# EAGLE schematic 15TB (EAGLE 9.6.0), part 2 of 2
## Sheet 4 of 4
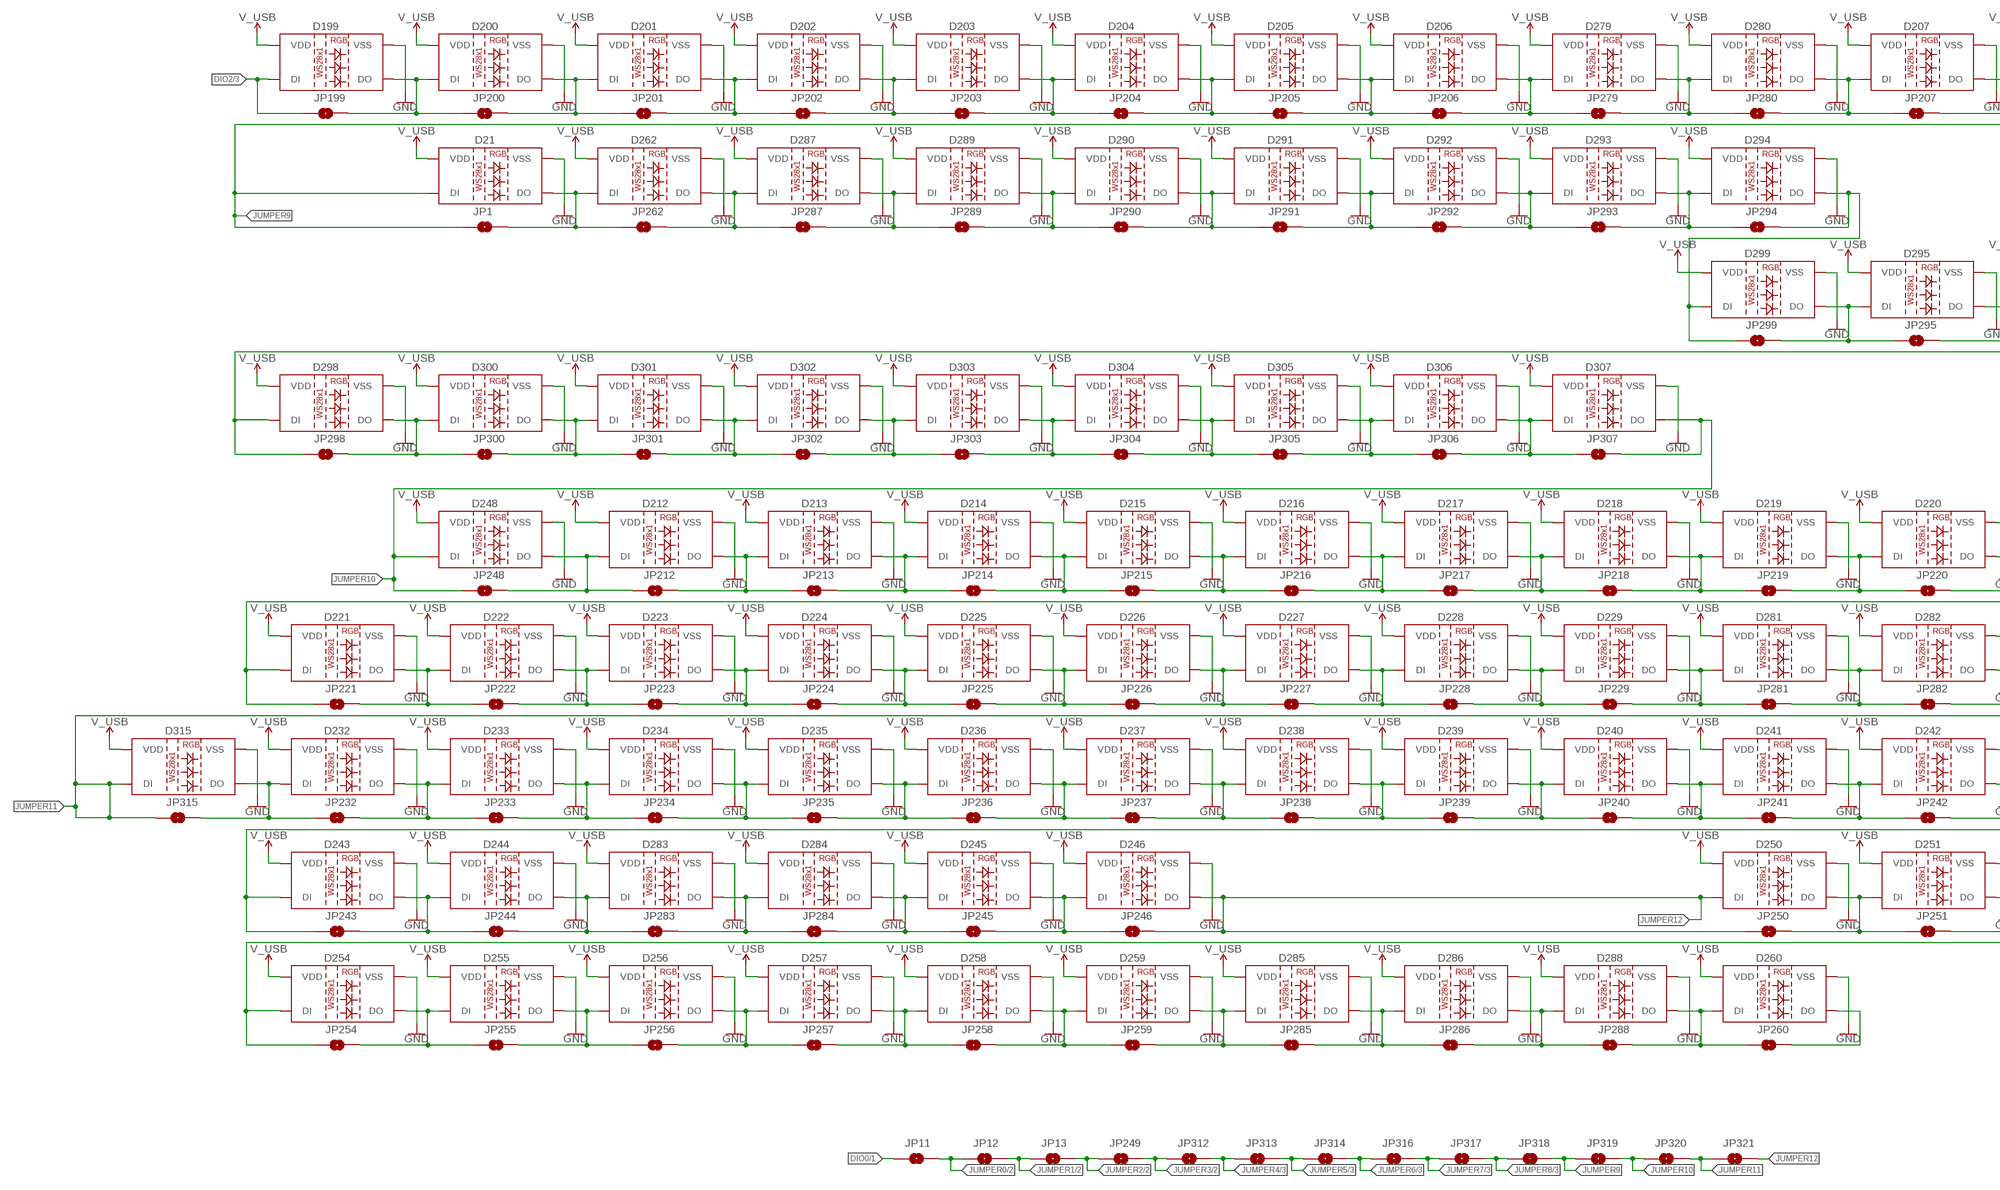
[diagram p5: schematic, sheet 4, part 1 of 2]
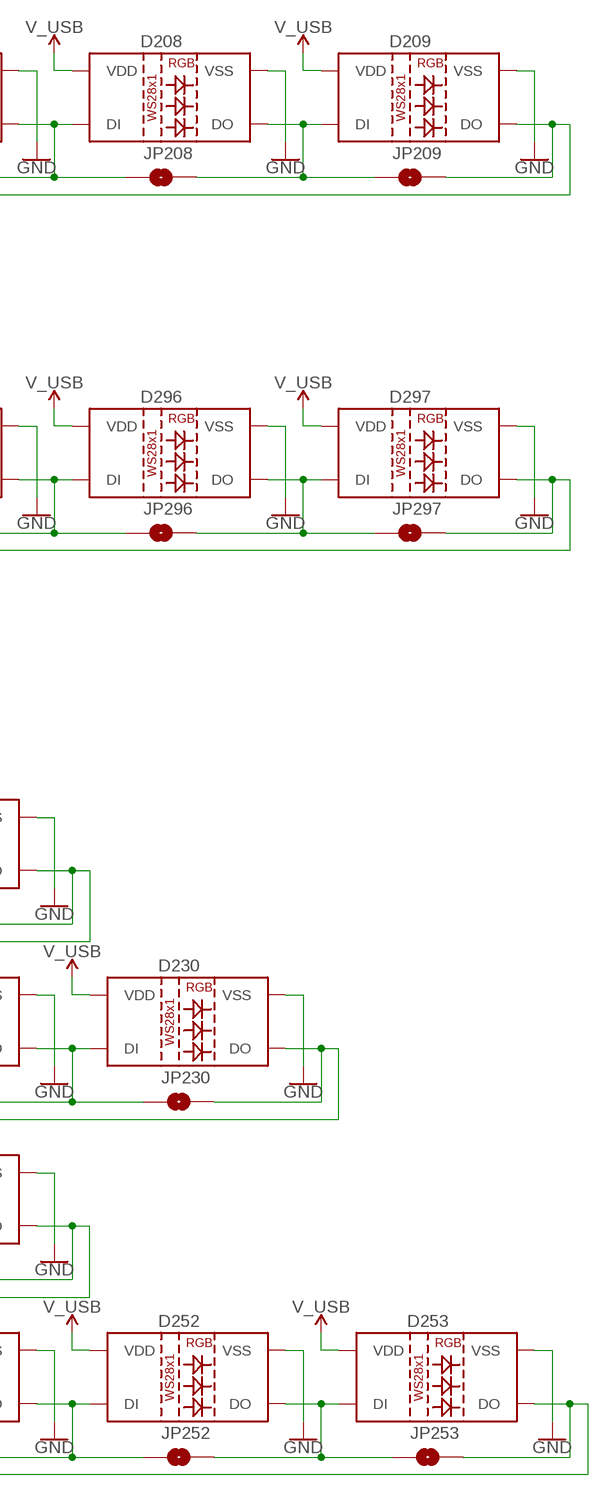
[diagram p6: schematic, sheet 4, part 2 of 2]

### Parts
D21  WS2812B  [WS2812B]
D199  WS2812B  [WS2812B]
D200  WS2812B  [WS2812B]
D201  WS2812B  [WS2812B]
D202  WS2812B  [WS2812B]
D203  WS2812B  [WS2812B]
D204  WS2812B  [WS2812B]
D205  WS2812B  [WS2812B]
D206  WS2812B  [WS2812B]
D207  WS2812B  [WS2812B]
D208  WS2812B  [WS2812B]
D209  WS2812B  [WS2812B]
D212  WS2812B  [WS2812B]
D213  WS2812B  [WS2812B]
D214  WS2812B  [WS2812B]
D215  WS2812B  [WS2812B]
D216  WS2812B  [WS2812B]
D217  WS2812B  [WS2812B]
D218  WS2812B  [WS2812B]
D219  WS2812B  [WS2812B]
D220  WS2812B  [WS2812B]
D221  WS2812B  [WS2812B]
D222  WS2812B  [WS2812B]
D223  WS2812B  [WS2812B]
D224  WS2812B  [WS2812B]
D225  WS2812B  [WS2812B]
D226  WS2812B  [WS2812B]
D227  WS2812B  [WS2812B]
D228  WS2812B  [WS2812B]
D229  WS2812B  [WS2812B]
D230  WS2812B  [WS2812B]
D232  WS2812B  [WS2812B]
D233  WS2812B  [WS2812B]
D234  WS2812B  [WS2812B]
D235  WS2812B  [WS2812B]
D236  WS2812B  [WS2812B]
D237  WS2812B  [WS2812B]
D238  WS2812B  [WS2812B]
D239  WS2812B  [WS2812B]
D240  WS2812B  [WS2812B]
D241  WS2812B  [WS2812B]
D242  WS2812B  [WS2812B]
D243  WS2812B  [WS2812B]
D244  WS2812B  [WS2812B]
D245  WS2812B  [WS2812B]
D246  WS2812B  [WS2812B]
D248  WS2812B  [WS2812B]
D250  WS2812B  [WS2812B]
D251  WS2812B  [WS2812B]
D252  WS2812B  [WS2812B]
D253  WS2812B  [WS2812B]
D254  WS2812B  [WS2812B]
D255  WS2812B  [WS2812B]
D256  WS2812B  [WS2812B]
D257  WS2812B  [WS2812B]
D258  WS2812B  [WS2812B]
D259  WS2812B  [WS2812B]
D260  WS2812B  [WS2812B]
D262  WS2812B  [WS2812B]
D279  WS2812B  [WS2812B]
D280  WS2812B  [WS2812B]
D281  WS2812B  [WS2812B]
D282  WS2812B  [WS2812B]
D283  WS2812B  [WS2812B]
D284  WS2812B  [WS2812B]
D285  WS2812B  [WS2812B]
D286  WS2812B  [WS2812B]
D287  WS2812B  [WS2812B]
D288  WS2812B  [WS2812B]
D289  WS2812B  [WS2812B]
D290  WS2812B  [WS2812B]
D291  WS2812B  [WS2812B]
D292  WS2812B  [WS2812B]
D293  WS2812B  [WS2812B]
D294  WS2812B  [WS2812B]
D295  WS2812B  [WS2812B]
D296  WS2812B  [WS2812B]
D297  WS2812B  [WS2812B]
D298  WS2812B  [WS2812B]
D299  WS2812B  [WS2812B]
D300  WS2812B  [WS2812B]
D301  WS2812B  [WS2812B]
D302  WS2812B  [WS2812B]
D303  WS2812B  [WS2812B]
D304  WS2812B  [WS2812B]
D305  WS2812B  [WS2812B]
D306  WS2812B  [WS2812B]
D307  WS2812B  [WS2812B]
D315  WS2812B  [WS2812B]
JP1  JUMPER-SMT_2_NO_NO-SILK  [SMT-JUMPER_2_NO_NO-SILK]
JP11  JUMPER-SMT_2_NO_NO-SILK  [SMT-JUMPER_2_NO_NO-SILK]
JP12  JUMPER-SMT_2_NO_NO-SILK  [SMT-JUMPER_2_NO_NO-SILK]
JP13  JUMPER-SMT_2_NO_NO-SILK  [SMT-JUMPER_2_NO_NO-SILK]
JP199  JUMPER-SMT_2_NO_NO-SILK  [SMT-JUMPER_2_NO_NO-SILK]
JP200  JUMPER-SMT_2_NO_NO-SILK  [SMT-JUMPER_2_NO_NO-SILK]
JP201  JUMPER-SMT_2_NO_NO-SILK  [SMT-JUMPER_2_NO_NO-SILK]
JP202  JUMPER-SMT_2_NO_NO-SILK  [SMT-JUMPER_2_NO_NO-SILK]
JP203  JUMPER-SMT_2_NO_NO-SILK  [SMT-JUMPER_2_NO_NO-SILK]
JP204  JUMPER-SMT_2_NO_NO-SILK  [SMT-JUMPER_2_NO_NO-SILK]
JP205  JUMPER-SMT_2_NO_NO-SILK  [SMT-JUMPER_2_NO_NO-SILK]
JP206  JUMPER-SMT_2_NO_NO-SILK  [SMT-JUMPER_2_NO_NO-SILK]
JP207  JUMPER-SMT_2_NO_NO-SILK  [SMT-JUMPER_2_NO_NO-SILK]
JP208  JUMPER-SMT_2_NO_NO-SILK  [SMT-JUMPER_2_NO_NO-SILK]
JP209  JUMPER-SMT_2_NO_NO-SILK  [SMT-JUMPER_2_NO_NO-SILK]
JP212  JUMPER-SMT_2_NO_NO-SILK  [SMT-JUMPER_2_NO_NO-SILK]
JP213  JUMPER-SMT_2_NO_NO-SILK  [SMT-JUMPER_2_NO_NO-SILK]
JP214  JUMPER-SMT_2_NO_NO-SILK  [SMT-JUMPER_2_NO_NO-SILK]
JP215  JUMPER-SMT_2_NO_NO-SILK  [SMT-JUMPER_2_NO_NO-SILK]
JP216  JUMPER-SMT_2_NO_NO-SILK  [SMT-JUMPER_2_NO_NO-SILK]
JP217  JUMPER-SMT_2_NO_NO-SILK  [SMT-JUMPER_2_NO_NO-SILK]
JP218  JUMPER-SMT_2_NO_NO-SILK  [SMT-JUMPER_2_NO_NO-SILK]
JP219  JUMPER-SMT_2_NO_NO-SILK  [SMT-JUMPER_2_NO_NO-SILK]
JP220  JUMPER-SMT_2_NO_NO-SILK  [SMT-JUMPER_2_NO_NO-SILK]
JP221  JUMPER-SMT_2_NO_NO-SILK  [SMT-JUMPER_2_NO_NO-SILK]
JP222  JUMPER-SMT_2_NO_NO-SILK  [SMT-JUMPER_2_NO_NO-SILK]
JP223  JUMPER-SMT_2_NO_NO-SILK  [SMT-JUMPER_2_NO_NO-SILK]
JP224  JUMPER-SMT_2_NO_NO-SILK  [SMT-JUMPER_2_NO_NO-SILK]
JP225  JUMPER-SMT_2_NO_NO-SILK  [SMT-JUMPER_2_NO_NO-SILK]
JP226  JUMPER-SMT_2_NO_NO-SILK  [SMT-JUMPER_2_NO_NO-SILK]
JP227  JUMPER-SMT_2_NO_NO-SILK  [SMT-JUMPER_2_NO_NO-SILK]
JP228  JUMPER-SMT_2_NO_NO-SILK  [SMT-JUMPER_2_NO_NO-SILK]
JP229  JUMPER-SMT_2_NO_NO-SILK  [SMT-JUMPER_2_NO_NO-SILK]
JP230  JUMPER-SMT_2_NO_NO-SILK  [SMT-JUMPER_2_NO_NO-SILK]
JP232  JUMPER-SMT_2_NO_NO-SILK  [SMT-JUMPER_2_NO_NO-SILK]
JP233  JUMPER-SMT_2_NO_NO-SILK  [SMT-JUMPER_2_NO_NO-SILK]
JP234  JUMPER-SMT_2_NO_NO-SILK  [SMT-JUMPER_2_NO_NO-SILK]
JP235  JUMPER-SMT_2_NO_NO-SILK  [SMT-JUMPER_2_NO_NO-SILK]
JP236  JUMPER-SMT_2_NO_NO-SILK  [SMT-JUMPER_2_NO_NO-SILK]
JP237  JUMPER-SMT_2_NO_NO-SILK  [SMT-JUMPER_2_NO_NO-SILK]
JP238  JUMPER-SMT_2_NO_NO-SILK  [SMT-JUMPER_2_NO_NO-SILK]
JP239  JUMPER-SMT_2_NO_NO-SILK  [SMT-JUMPER_2_NO_NO-SILK]
JP240  JUMPER-SMT_2_NO_NO-SILK  [SMT-JUMPER_2_NO_NO-SILK]
JP241  JUMPER-SMT_2_NO_NO-SILK  [SMT-JUMPER_2_NO_NO-SILK]
JP242  JUMPER-SMT_2_NO_NO-SILK  [SMT-JUMPER_2_NO_NO-SILK]
JP243  JUMPER-SMT_2_NO_NO-SILK  [SMT-JUMPER_2_NO_NO-SILK]
JP244  JUMPER-SMT_2_NO_NO-SILK  [SMT-JUMPER_2_NO_NO-SILK]
JP245  JUMPER-SMT_2_NO_NO-SILK  [SMT-JUMPER_2_NO_NO-SILK]
JP246  JUMPER-SMT_2_NO_NO-SILK  [SMT-JUMPER_2_NO_NO-SILK]
JP248  JUMPER-SMT_2_NO_NO-SILK  [SMT-JUMPER_2_NO_NO-SILK]
JP249  JUMPER-SMT_2_NO_NO-SILK  [SMT-JUMPER_2_NO_NO-SILK]
JP250  JUMPER-SMT_2_NO_NO-SILK  [SMT-JUMPER_2_NO_NO-SILK]
JP251  JUMPER-SMT_2_NO_NO-SILK  [SMT-JUMPER_2_NO_NO-SILK]
JP252  JUMPER-SMT_2_NO_NO-SILK  [SMT-JUMPER_2_NO_NO-SILK]
JP253  JUMPER-SMT_2_NO_NO-SILK  [SMT-JUMPER_2_NO_NO-SILK]
JP254  JUMPER-SMT_2_NO_NO-SILK  [SMT-JUMPER_2_NO_NO-SILK]
JP255  JUMPER-SMT_2_NO_NO-SILK  [SMT-JUMPER_2_NO_NO-SILK]
JP256  JUMPER-SMT_2_NO_NO-SILK  [SMT-JUMPER_2_NO_NO-SILK]
JP257  JUMPER-SMT_2_NO_NO-SILK  [SMT-JUMPER_2_NO_NO-SILK]
JP258  JUMPER-SMT_2_NO_NO-SILK  [SMT-JUMPER_2_NO_NO-SILK]
JP259  JUMPER-SMT_2_NO_NO-SILK  [SMT-JUMPER_2_NO_NO-SILK]
JP260  JUMPER-SMT_2_NO_NO-SILK  [SMT-JUMPER_2_NO_NO-SILK]
JP262  JUMPER-SMT_2_NO_NO-SILK  [SMT-JUMPER_2_NO_NO-SILK]
JP279  JUMPER-SMT_2_NO_NO-SILK  [SMT-JUMPER_2_NO_NO-SILK]
JP280  JUMPER-SMT_2_NO_NO-SILK  [SMT-JUMPER_2_NO_NO-SILK]
JP281  JUMPER-SMT_2_NO_NO-SILK  [SMT-JUMPER_2_NO_NO-SILK]
JP282  JUMPER-SMT_2_NO_NO-SILK  [SMT-JUMPER_2_NO_NO-SILK]
JP283  JUMPER-SMT_2_NO_NO-SILK  [SMT-JUMPER_2_NO_NO-SILK]
JP284  JUMPER-SMT_2_NO_NO-SILK  [SMT-JUMPER_2_NO_NO-SILK]
JP285  JUMPER-SMT_2_NO_NO-SILK  [SMT-JUMPER_2_NO_NO-SILK]
JP286  JUMPER-SMT_2_NO_NO-SILK  [SMT-JUMPER_2_NO_NO-SILK]
JP287  JUMPER-SMT_2_NO_NO-SILK  [SMT-JUMPER_2_NO_NO-SILK]
JP288  JUMPER-SMT_2_NO_NO-SILK  [SMT-JUMPER_2_NO_NO-SILK]
JP289  JUMPER-SMT_2_NO_NO-SILK  [SMT-JUMPER_2_NO_NO-SILK]
JP290  JUMPER-SMT_2_NO_NO-SILK  [SMT-JUMPER_2_NO_NO-SILK]
JP291  JUMPER-SMT_2_NO_NO-SILK  [SMT-JUMPER_2_NO_NO-SILK]
JP292  JUMPER-SMT_2_NO_NO-SILK  [SMT-JUMPER_2_NO_NO-SILK]
JP293  JUMPER-SMT_2_NO_NO-SILK  [SMT-JUMPER_2_NO_NO-SILK]
JP294  JUMPER-SMT_2_NO_NO-SILK  [SMT-JUMPER_2_NO_NO-SILK]
JP295  JUMPER-SMT_2_NO_NO-SILK  [SMT-JUMPER_2_NO_NO-SILK]
JP296  JUMPER-SMT_2_NO_NO-SILK  [SMT-JUMPER_2_NO_NO-SILK]
JP297  JUMPER-SMT_2_NO_NO-SILK  [SMT-JUMPER_2_NO_NO-SILK]
JP298  JUMPER-SMT_2_NO_NO-SILK  [SMT-JUMPER_2_NO_NO-SILK]
JP299  JUMPER-SMT_2_NO_NO-SILK  [SMT-JUMPER_2_NO_NO-SILK]
JP300  JUMPER-SMT_2_NO_NO-SILK  [SMT-JUMPER_2_NO_NO-SILK]
JP301  JUMPER-SMT_2_NO_NO-SILK  [SMT-JUMPER_2_NO_NO-SILK]
JP302  JUMPER-SMT_2_NO_NO-SILK  [SMT-JUMPER_2_NO_NO-SILK]
JP303  JUMPER-SMT_2_NO_NO-SILK  [SMT-JUMPER_2_NO_NO-SILK]
JP304  JUMPER-SMT_2_NO_NO-SILK  [SMT-JUMPER_2_NO_NO-SILK]
JP305  JUMPER-SMT_2_NO_NO-SILK  [SMT-JUMPER_2_NO_NO-SILK]
JP306  JUMPER-SMT_2_NO_NO-SILK  [SMT-JUMPER_2_NO_NO-SILK]
JP307  JUMPER-SMT_2_NO_NO-SILK  [SMT-JUMPER_2_NO_NO-SILK]
JP312  JUMPER-SMT_2_NO_NO-SILK  [SMT-JUMPER_2_NO_NO-SILK]
JP313  JUMPER-SMT_2_NO_NO-SILK  [SMT-JUMPER_2_NO_NO-SILK]
JP314  JUMPER-SMT_2_NO_NO-SILK  [SMT-JUMPER_2_NO_NO-SILK]
JP315  JUMPER-SMT_2_NO_NO-SILK  [SMT-JUMPER_2_NO_NO-SILK]
JP316  JUMPER-SMT_2_NO_NO-SILK  [SMT-JUMPER_2_NO_NO-SILK]
JP317  JUMPER-SMT_2_NO_NO-SILK  [SMT-JUMPER_2_NO_NO-SILK]
JP318  JUMPER-SMT_2_NO_NO-SILK  [SMT-JUMPER_2_NO_NO-SILK]
JP319  JUMPER-SMT_2_NO_NO-SILK  [SMT-JUMPER_2_NO_NO-SILK]
JP320  JUMPER-SMT_2_NO_NO-SILK  [SMT-JUMPER_2_NO_NO-SILK]
JP321  JUMPER-SMT_2_NO_NO-SILK  [SMT-JUMPER_2_NO_NO-SILK]

### Nets
DIO0: JP11.1 ; also sheet 1,2
DIO2: D199.4(DI) JP199.1 ; also sheet 3
DIO105: D202.2(DO) D203.4(DI) JP202.2 JP203.1
DIO106: D204.2(DO) D205.4(DI) JP204.2 JP205.1
DIO107: D279.2(DO) D280.4(DI) JP279.2 JP280.1
DIO108: D208.2(DO) D209.4(DI) JP208.2 JP209.1
DIO110: D213.2(DO) D214.4(DI) JP213.2 JP214.1
DIO111: D215.2(DO) D216.4(DI) JP215.2 JP216.1
DIO112: D217.2(DO) D218.4(DI) JP217.2 JP218.1
DIO113: D219.2(DO) D220.4(DI) JP219.2 JP220.1
DIO114: D220.2(DO) D221.4(DI) JP220.2 JP221.1
DIO115: D222.2(DO) D223.4(DI) JP222.2 JP223.1
DIO116: D224.2(DO) D225.4(DI) JP224.2 JP225.1
DIO117: D226.2(DO) D227.4(DI) JP226.2 JP227.1
DIO118: D228.2(DO) D229.4(DI) JP228.2 JP229.1
DIO122: D233.2(DO) D234.4(DI) JP233.2 JP234.1
DIO123: D235.2(DO) D236.4(DI) JP235.2 JP236.1
DIO124: D237.2(DO) D238.4(DI) JP237.2 JP238.1
DIO125: D239.2(DO) D240.4(DI) JP239.2 JP240.1
DIO126: D241.2(DO) D242.4(DI) JP241.2 JP242.1
DIO128: D242.2(DO) D243.4(DI) JP242.2 JP243.1
DIO129: D283.2(DO) D284.4(DI) JP283.2 JP284.1
DIO132: D250.2(DO) D251.4(DI) JP250.2 JP251.1
DIO133: D252.2(DO) D253.4(DI) JP252.2 JP253.1
DIO134: D253.2(DO) D254.4(DI) JP253.2 JP254.1
DIO135: D255.2(DO) D256.4(DI) JP255.2 JP256.1
DIO136: D257.2(DO) D258.4(DI) JP257.2 JP258.1
DIO137: D285.2(DO) D286.4(DI) JP285.2 JP286.1
DIO138: D262.2(DO) D287.4(DI) JP262.2 JP287.1
DIO139: D281.2(DO) D282.4(DI) JP281.2 JP282.1
DIO140: D289.2(DO) D290.4(DI) JP289.2 JP290.1
DIO141: D291.2(DO) D292.4(DI) JP291.2 JP292.1
DIO142: D293.2(DO) D294.4(DI) JP293.2 JP294.1
DIO144: D297.2(DO) D298.4(DI) JP297.2 JP298.1
DIO145: D296.2(DO) D297.4(DI) JP296.2 JP297.1
DIO146: D298.2(DO) D300.4(DI) JP298.2 JP300.1
DIO147: D294.2(DO) D299.4(DI) JP294.2 JP299.1
DIO148: D301.2(DO) D302.4(DI) JP301.2 JP302.1
DIO149: D303.2(DO) D304.4(DI) JP303.2 JP304.1
DIO150: D305.2(DO) D306.4(DI) JP305.2 JP306.1
DIO153: D232.4(DI) D315.2(DO) JP232.1 JP315.2
GND: D21.3(VSS) D199.3(VSS) D200.3(VSS) D201.3(VSS) D202.3(VSS) D203.3(VSS) D204.3(VSS) D205.3(VSS) D206.3(VSS) D207.3(VSS) D208.3(VSS) D209.3(VSS) D212.3(VSS) D213.3(VSS) D214.3(VSS) D215.3(VSS) D216.3(VSS) D217.3(VSS) D218.3(VSS) D219.3(VSS) D220.3(VSS) D221.3(VSS) D222.3(VSS) D223.3(VSS) D224.3(VSS) D225.3(VSS) D226.3(VSS) D227.3(VSS) D228.3(VSS) D229.3(VSS) D230.3(VSS) D232.3(VSS) D233.3(VSS) D234.3(VSS) D235.3(VSS) D236.3(VSS) D237.3(VSS) D238.3(VSS) D239.3(VSS) D240.3(VSS) D241.3(VSS) D242.3(VSS) D243.3(VSS) D244.3(VSS) D245.3(VSS) D246.3(VSS) D248.3(VSS) D250.3(VSS) D251.3(VSS) D252.3(VSS) D253.3(VSS) D254.3(VSS) D255.3(VSS) D256.3(VSS) D257.3(VSS) D258.3(VSS) D259.3(VSS) D260.3(VSS) D262.3(VSS) D279.3(VSS) D280.3(VSS) D281.3(VSS) D282.3(VSS) D283.3(VSS) D284.3(VSS) D285.3(VSS) D286.3(VSS) D287.3(VSS) D288.3(VSS) D289.3(VSS) D290.3(VSS) D291.3(VSS) D292.3(VSS) D293.3(VSS) D294.3(VSS) D295.3(VSS) D296.3(VSS) D297.3(VSS) D298.3(VSS) D299.3(VSS) D300.3(VSS) D301.3(VSS) D302.3(VSS) D303.3(VSS) D304.3(VSS) D305.3(VSS) D306.3(VSS) D307.3(VSS) D315.3(VSS) ; also sheet 1,2,3
JUMPER0: JP11.2 JP12.1 ; also sheet 2
JUMPER1: JP12.2 JP13.1 ; also sheet 2
JUMPER2: JP13.2 JP249.1 ; also sheet 2
JUMPER3: JP249.2 JP312.1 ; also sheet 2
JUMPER4: JP312.2 JP313.1 ; also sheet 3
JUMPER5: JP313.2 JP314.1 ; also sheet 3
JUMPER6: JP314.2 JP316.1 ; also sheet 3
JUMPER7: JP316.2 JP317.1 ; also sheet 3
JUMPER8: JP317.2 JP318.1 ; also sheet 3
JUMPER9: D21.4(DI) D209.2(DO) JP1.1 JP209.2 JP318.2 JP319.1
JUMPER10: D248.4(DI) D307.2(DO) JP248.1 JP307.2 JP319.2 JP320.1
JUMPER11: D230.2(DO) D315.4(DI) JP230.2 JP315.1 JP320.2 JP321.1
JUMPER12: D246.2(DO) D250.4(DI) JP246.2 JP250.1 JP321.2
N$102: D199.2(DO) D200.4(DI) JP199.2 JP200.1
N$103: D203.2(DO) D204.4(DI) JP203.2 JP204.1
N$104: D201.2(DO) D202.4(DI) JP201.2 JP202.1
N$105: D207.2(DO) D208.4(DI) JP207.2 JP208.1
N$106: D205.2(DO) D206.4(DI) JP205.2 JP206.1
N$108: D214.2(DO) D215.4(DI) JP214.2 JP215.1
N$109: D212.2(DO) D213.4(DI) JP212.2 JP213.1
N$110: D218.2(DO) D219.4(DI) JP218.2 JP219.1
N$111: D216.2(DO) D217.4(DI) JP216.2 JP217.1
N$112: D221.2(DO) D222.4(DI) JP221.2 JP222.1
N$113: D225.2(DO) D226.4(DI) JP225.2 JP226.1
N$114: D223.2(DO) D224.4(DI) JP223.2 JP224.1
N$115: D230.4(DI) D282.2(DO) JP230.1 JP282.2
N$116: D227.2(DO) D228.4(DI) JP227.2 JP228.1
N$117: D232.2(DO) D233.4(DI) JP232.2 JP233.1
N$118: D236.2(DO) D237.4(DI) JP236.2 JP237.1
N$119: D234.2(DO) D235.4(DI) JP234.2 JP235.1
N$122: D240.2(DO) D241.4(DI) JP240.2 JP241.1
N$123: D238.2(DO) D239.4(DI) JP238.2 JP239.1
N$124: D243.2(DO) D244.4(DI) JP243.2 JP244.1
N$125: D212.4(DI) D248.2(DO) JP212.1 JP248.2
N$126: D245.2(DO) D246.4(DI) JP245.2 JP246.1
N$127: D251.2(DO) D252.4(DI) JP251.2 JP252.1
N$129: D254.2(DO) D255.4(DI) JP254.2 JP255.1
N$130: D258.2(DO) D259.4(DI) JP258.2 JP259.1
N$131: D256.2(DO) D257.4(DI) JP256.2 JP257.1
N$133: D260.2(DO) JP260.2
N$136: D200.2(DO) D201.4(DI) JP200.2 JP201.1
N$138: D287.2(DO) D289.4(DI) JP287.2 JP289.1
N$153: D207.4(DI) D280.2(DO) JP207.1 JP280.2
N$154: D206.2(DO) D279.4(DI) JP206.2 JP279.1
N$155: D229.2(DO) D281.4(DI) JP229.2 JP281.1
N$156: D245.4(DI) D284.2(DO) JP245.1 JP284.2
N$157: D244.2(DO) D283.4(DI) JP244.2 JP283.1
N$158: D286.2(DO) D288.4(DI) JP286.2 JP288.1
N$159: D259.2(DO) D285.4(DI) JP259.2 JP285.1
N$160: D260.4(DI) D288.2(DO) JP260.1 JP288.2
N$161: D21.2(DO) D262.4(DI) JP1.2 JP262.1
N$162: D292.2(DO) D293.4(DI) JP292.2 JP293.1
N$163: D290.2(DO) D291.4(DI) JP290.2 JP291.1
N$164: D295.2(DO) D296.4(DI) JP295.2 JP296.1
N$165: D295.4(DI) D299.2(DO) JP295.1 JP299.2
N$166: D302.2(DO) D303.4(DI) JP302.2 JP303.1
N$167: D300.2(DO) D301.4(DI) JP300.2 JP301.1
N$168: D306.2(DO) D307.4(DI) JP306.2 JP307.1
N$169: D304.2(DO) D305.4(DI) JP304.2 JP305.1
V_USB: D21.1(VDD) D199.1(VDD) D200.1(VDD) D201.1(VDD) D202.1(VDD) D203.1(VDD) D204.1(VDD) D205.1(VDD) D206.1(VDD) D207.1(VDD) D208.1(VDD) D209.1(VDD) D212.1(VDD) D213.1(VDD) D214.1(VDD) D215.1(VDD) D216.1(VDD) D217.1(VDD) D218.1(VDD) D219.1(VDD) D220.1(VDD) D221.1(VDD) D222.1(VDD) D223.1(VDD) D224.1(VDD) D225.1(VDD) D226.1(VDD) D227.1(VDD) D228.1(VDD) D229.1(VDD) D230.1(VDD) D232.1(VDD) D233.1(VDD) D234.1(VDD) D235.1(VDD) D236.1(VDD) D237.1(VDD) D238.1(VDD) D239.1(VDD) D240.1(VDD) D241.1(VDD) D242.1(VDD) D243.1(VDD) D244.1(VDD) D245.1(VDD) D246.1(VDD) D248.1(VDD) D250.1(VDD) D251.1(VDD) D252.1(VDD) D253.1(VDD) D254.1(VDD) D255.1(VDD) D256.1(VDD) D257.1(VDD) D258.1(VDD) D259.1(VDD) D260.1(VDD) D262.1(VDD) D279.1(VDD) D280.1(VDD) D281.1(VDD) D282.1(VDD) D283.1(VDD) D284.1(VDD) D285.1(VDD) D286.1(VDD) D287.1(VDD) D288.1(VDD) D289.1(VDD) D290.1(VDD) D291.1(VDD) D292.1(VDD) D293.1(VDD) D294.1(VDD) D295.1(VDD) D296.1(VDD) D297.1(VDD) D298.1(VDD) D299.1(VDD) D300.1(VDD) D301.1(VDD) D302.1(VDD) D303.1(VDD) D304.1(VDD) D305.1(VDD) D306.1(VDD) D307.1(VDD) D315.1(VDD) ; also sheet 1,2,3

## Library data of the parts
C1 = SparkFun-Capacitors:10UF: 10.0µF ceramic capacitors A capacitor is a passive two-terminal electrical component used to store electrical energy temporarily in an electric field.; PROD_ID: CAP-11015
C2 C3 C9 = SparkFun-Capacitors:0.1UF: 0.1µF ceramic capacitors A capacitor is a passive two-terminal electrical component used to store electrical energy temporarily in an electric field.; PROD_ID: CAP-08604
C4 = SparkFun-Capacitors:4.7UF: 4.7µF ceramic capacitors A capacitor is a passive two-terminal electrical component used to store electrical energy temporarily in an electric field.; PROD_ID: CAP-08280
C5 = SparkFun-Capacitors:100PF: 100pF/0.1nF ceramic capacitors A capacitor is a passive two-terminal electrical component used to store electrical energy temporarily in an electric field.; PROD_ID: CAP-07883
C6-C8 = SparkFun-Capacitors:1.0UF: 1µF ceramic capacitors A capacitor is a passive two-terminal electrical component used to store electrical energy temporarily in an electric field.; PROD_ID: CAP-00868
D1-D10 D14-D83 D85-D167 D169-D188 D190-D209 D212-D230 D232-D246 D248 D250-D260 D262 D263 D265 D267-D269 D271 D273 D275-D307 D315 = SparkFun-LED:WS2812B: WS2812B SMD addressable RGB LED 5x5mm SMD LED with built-in controller IC. Color: Red/Green/Blue mC Rating: RGB: 390, 660, 180 mcd Forward Voltage: RGB: 2.0, 3.0, 3.0 V Packages:WS2812B SparkFun Products: Blynk Board - ESP8266 <https://www.sparkfun.com/products/13794>; PROD_ID: DIO-12503
FD1 FD4 = SparkFun-Aesthetics:FIDUCIAL: Fiducial Alignment Points Point-of-reference for pick-and-place machines and other optical instruments.
H1-H6 = SparkFun-Hardware:STAND-OFF: Stand Off Drill holes for mechanically mounting via screws, standoffs, etc. Note: Use the keepout ring to avoid running the screw head into surrounding components. Variant Overviews STAND-OFF - Mechanical footprint for a #4 phillips button head screw. STAND-OFF-TIGHT - Mechanical footprint for a #4 phillips button head screw, Example SparkFun Products Screw - Phillips Head (1/4", 4-40, 10 pack) <https://www.sparkfun.com/products/10453> (PRT-10453) Screw - Phillips Head (1/2", 4-40, 10 pack) <https://www.sparkfun.com/products/10452> (PRT-10452) Screw - Phillips Head (3/4", 4-40, 10 pack) <https://www.sparkfun.com/products/10451> (PRT-10451) Screw - Phillips Head (1", 4-40, 10 pack) <https://www.sparkfun.com/products/10450> (PRT-10450)
J2 = SparkFun-Connectors:USB_C: USB Type C 16Pin Connector Super Speed pins not available on the 16-pin purely SMD connector so this part is best for USB 2.0 implementations. D1 and D2 are tied together enabling D+/- no matter which way the cable is plugged into the connector. The two channel configuration pins (CC1/2) are exposed. These are normally connected to ground via 5.1k resistors but can be reconfigured for high current/high power applications.; PROD_ID: CONN-14122
J3 = SparkFun-Connectors:AUDIO_JACK_TRRS: Audio Jack - 3.5mm TRRS (SMD) This is a 3.5mm TRRS SMD audio jack. TRRS connectors are the audio-style connectors that you see on some phones, MP3 players and development boards. TRRS stands for “tip, ring, ring, sleeve,” which reflects that this has three conductors and a ground. SparkFun Products: Audio Jack <https://www.sparkfun.com/products/12639> mbed Starter Kit <https://www.sparkfun.com/products/12968> SparkFun TRRS 3.5mm Jack Breakout <https://www.sparkfun.com/products/11570>; PROD_ID: CONN-10676; SF_ID: PRT-12639
JP1-JP83 JP85-JP167 JP169-JP188 JP190-JP209 JP212-JP230 JP232-JP246 JP248-JP260 JP262 JP263 JP265 JP267-JP269 JP271 JP273 JP275-JP307 JP312-JP321 = SparkFun-Jumpers:JUMPER-SMT_2_NO: Normally open jumper This jumper has two pads in close proximity to each other. Apply solder to close the connection. Round pads are easier to solder for beginners, but are a lot larger. SparkFun Product that uses the round pads: SparkFun EL Sequencer <https://www.sparkfun.com/products/12781>
Q2 = SparkFun-DiscreteSemi:TRANS_NPN_DUAL: Dual NPN Transistors in Single Package The MBT3904W1 puts two general purpose 3904 NPN transistors in a single package. Datasheet <http://www.onsemi.com/pub_link/Collateral/MBT3904DW1T1-D.PDF> SparkFun Products: SparkFun ESP32 Thing <https://www.sparkfun.com/products/13907>; PROD_ID: TRANS-13337
R1 R14 R15 = SparkFun-Resistors:1KOHM: 1kΩ resistor A resistor is a passive two-terminal electrical component that implements electrical resistance as a circuit element. Resistors act to reduce current flow, and, at the same time, act to lower voltage levels within circuits. - Wikipedia; PROD_ID: RES-07856
R2 R9 R10 R17 R18 = SparkFun-Resistors:10KOHM: 10kΩ resistor A resistor is a passive two-terminal electrical component that implements electrical resistance as a circuit element. Resistors act to reduce current flow, and, at the same time, act to lower voltage levels within circuits. - Wikipedia; PROD_ID: RES-00824
R3 R4 = SparkFun-Resistors:5.1KOHM; PROD_ID: RES-12083
R5-R8 R11 R12 = SparkFun-Resistors:100KOHM: 100kΩ resistor A resistor is a passive two-terminal electrical component that implements electrical resistance as a circuit element. Resistors act to reduce current flow, and, at the same time, act to lower voltage levels within circuits. - Wikipedia; PROD_ID: RES-07828
R13 = SparkFun-Resistors:2.2KOHM: 2.2kΩ resistor A resistor is a passive two-terminal electrical component that implements electrical resistance as a circuit element. Resistors act to reduce current flow, and, at the same time, act to lower voltage levels within circuits. - Wikipedia; PROD_ID: RES-08272
R16 = SparkFun-Resistors:100OHM: 100Ω resistor A resistor is a passive two-terminal electrical component that implements electrical resistance as a circuit element. Resistors act to reduce current flow, and, at the same time, act to lower voltage levels within circuits. - Wikipedia; PROD_ID: RES-07863
S1 S2 = SparkFun-Switches:MOMENTARY-SWITCH-SPST-2: Momentary Switch (Pushbutton) - SPST - Two Circuits Normally-open (NO) SPST momentary switches (buttons, pushbuttons). Schematic symbol includes two switch circuits. Variants SMD-4.6MMX2.8MM - 4.60mm x 2.80mm Tactile Momentary Button Switch - Used on SparkFun SAMD21 Mini Breakout <https://www.sparkfun.com/products/13664> SMD-5.2MM - Mini Pushbutton Switch - SMD <https://www.sparkfun.com/products/8720> - Used on Arduino Pro Mini <https://www.sparkfun.com/products/11114>; PROD_ID: SWCH-13065
U2 = SparkFun-RF:ESP-WROOM-32; PROD_ID: IC-13849
U3 = SparkFun-PowerIC:V_REG_LDO: Voltage Regulator LDO Standard 150mA LDO voltage regulator in SOT-23 layout. Micrel part MIC5205. BP (by-pass) pin is used to lower output noise with 470pF cap.; PROD_ID: VREG-12457
U4 = SparkFun-IC-Comms:CP2102N; PROD_ID: IC-14020
U5 = SparkFun-Sensors:ADMP401: ADMP401 - Omnidirection Bottom-Port MEMS Microphone The ADMP401 is a high quality, low cost, low power analog output bottom-ported omnidirectional MEMS microphone. The ADMP401 consists of a MEMS microphone element, an impedance converter, and an output amplifier. The ADMP401 sensitivity specification makes it an excellent choice for both near field and far field applications. Datasheet <http://www.analog.com/media/en/technical-documentation/obsolete-data-sheets/ADMP401.pdf> SparkFun Products SparkFun MEMS Microphone Breakout - INMP401 (ADMP401) <https://www.sparkfun.com/products/9868> (BOB-09868) MEMS Microphone - INMP401 (ADMP401) <https://www.sparkfun.com/products/10028> (COM-10028); PROD_ID: IC-09773
U$2 = SparkFun-IC-Amplifiers:OPA344: Single gate rail-to-rail output op-amp. Inputs extend 300mV past rails. Datasheet <http://www.ti.com/product/OPA344> SparkFun Products SparkFun Low Current Sensor <https://www.sparkfun.com/products/8883> (SEN-08883) SparkFun Electret Microphone Breakout <https://www.sparkfun.com/products/12758> (BOB-12758); PROD_ID: IC-08251; SPICEPREFIX: U